# Altium schematic sheet SCS_Charger_RevA.SchDoc
size A3; _PRJ_TITLE: PROJECT TITLE; _SHT_TITLE: Sheet; _REV: A; PageSetup: Record=PageOptions|CenterHorizontal=True|CenterVertical=True|PrintScale=0.71|XCorrection=1.00|YCorrection=1.00|PrintKind=0|BorderSize=5000000|LeftOffset=0|BottomOffset=0|Orientation=2|PaperLength=1000|PaperWidth=1000|Scale=100|PaperSource=258|PrintQuality=600|MediaType=1|DitherType=10|PaperKind=A3 (297x420mm)|PrintScaleMode=1
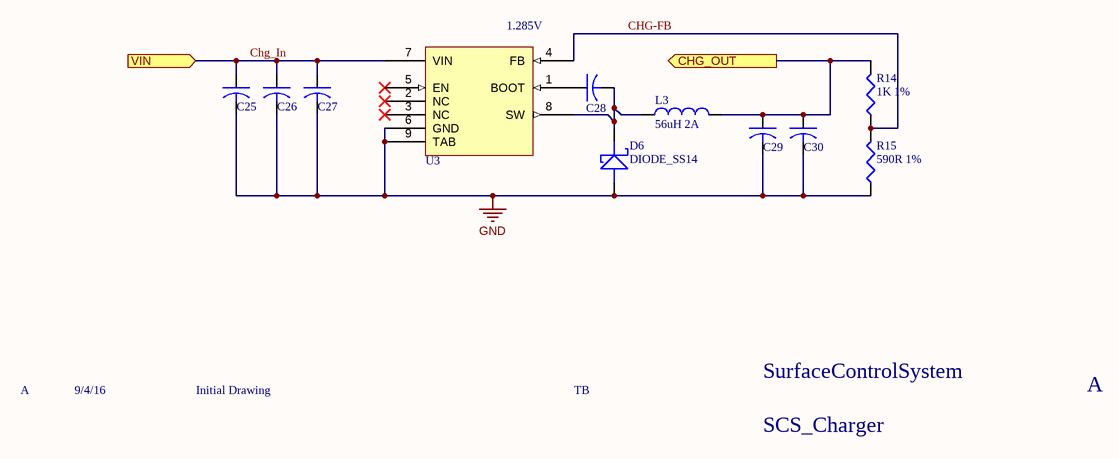
[diagram p0: SCS_Charger_RevA.SchDoc]

## Parts
C25  10UF 25V  [1206]  (value not drawn)
C26  10UF 25V  [1206]  (value not drawn)
C27  100nF 50V  [0603]  (value not drawn)
C28  10NF 50V  [0603]  (value not drawn)
C29  10UF 25V  [1206]  (value not drawn)
C30  10UF 25V  [1206]  (value not drawn)
D6  DIODE_SS14  [DO-214AC]
L3  56uH 2A  [Wurth744771156]
R14  1K 1%  [0603]
R15  590R 1%  [0603]
U3  Buck Reg  [PSOP-8]  (value not drawn)

## Ports
CHG_OUT (out), VIN (in)

## Nets
GND: C25.2 C26.2 C27.2 C29.2 C30.2 D6.A R15.1 U3.6(GND) U3.9(TAB)
CHG-FB: R14.1 R15.2 U3.4(FB)
Chg_In: C25.1 C26.1 C27.1 U3.7(VIN) ; port VIN
CHG_OUT: C29.1 C30.1 L3.2 R14.2 ; port CHG_OUT
NetC28_1: C28.1 U3.1(BOOT)
NetC28_2: C28.2 D6.K L3.1 U3.8(SW)

Not connected (* = marked no-connect by the designer): U3 2(NC)* 3(NC)* 5(EN)*

## Notes on the sheet
- (near U3) 1.285V
- SurfaceControlSystem
- A
- 9/4/16
- Initial Drawing
- TB
- SCS_Charger
- TEMPLATE MODIFIED 09/04/16
- PCBA REV
- DATE
- ECO
- DESCRIPTION
- DRAWN
- APPROVED
- FILE NAME
- PCB REVISION
- Sheet NAME
- SCALE
- SHEET
- NTS
- SHEET SIZE
- A3

## Library data of the parts
C25 C26 C29 C30 = CAP_10UF_25V_10%_1206: CAP CER 10UF 25V 10% X5R 1206; Manufacturer: Murata; Manufacturer P/N: GRM319R61E106KA12D
C27 = CAP_100NF_50V_10%_0603: CAP CER 100nF 50V 10% X7R 0603; Manufacturer: Murata; Manufacturer P/N: GRM188R71H104KA93D
C28 = CAP_10NF_50V_10%_0603: CAP CER 10NF 50V 10% X7R 0603; Manufacturer: Murata; Manufacturer P/N: GRM188R71H103KA01D
D6 = DIODE_SS14: Schottky Diode, 1A, 40V SS14; Manufacturer: Fairchild; Manufacturer P/N: SS14
L3 = IND_56uH_2.01A: FIXED IND 56UH 2.01A 110 MOHM; Manufacturer: Wurth Electronics Inc; Manufacturer P/N: 744771156
R14 = RES_1K_1%_0603: Resistor, 1K, 1%, 0603; Manufacturer: Bourns Inc; Manufacturer P/N: CR0603-FX-1001ELF
R15 = RES_590R_1%_0603: Resistor, 590R, 1%, 0603; Manufacturer: Bourns Inc; Manufacturer P/N: CR0603-FX-5900ELF
U3 = IC_REG_LM22675: IC REG BUCK 5V 1A 8SOPWRPAD; Manufacturer: Texas Instruments; Manufacturer P/N: LM22675MRE-5.0/NOPB